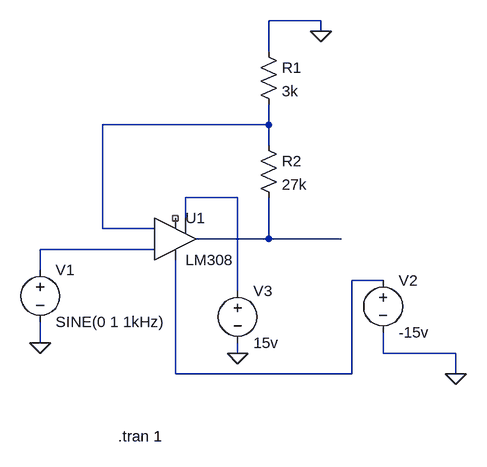
[diagram p0: schematic OpAmp.asc]
OpAmp.asc, the LTspice schematic file:
Version 4
SHEET 1 880 680
WIRE 448 -160 368 -160
WIRE 448 -144 448 -160
WIRE 368 -112 368 -160
WIRE 368 0 368 -32
WIRE 368 0 112 0
WIRE 368 32 368 0
WIRE 320 112 240 112
WIRE 240 144 240 112
WIRE 112 160 112 0
WIRE 192 160 112 160
WIRE 368 176 368 112
WIRE 368 176 256 176
WIRE 480 176 368 176
WIRE 192 192 16 192
WIRE 16 224 16 192
WIRE 544 240 496 240
WIRE 320 256 320 112
WIRE 16 336 16 304
WIRE 320 352 320 336
WIRE 544 352 544 320
WIRE 656 352 544 352
WIRE 224 384 224 208
WIRE 496 384 496 240
WIRE 496 384 224 384
WIRE 656 384 656 352
FLAG 16 336 0
FLAG 448 -144 0
FLAG 320 352 0
FLAG 656 384 0
SYMBOL Opamps\\LM308 224 112 R0
SYMATTR InstName U1
SYMBOL res 352 16 R0
SYMATTR InstName R2
SYMATTR Value 27k
SYMBOL res 352 -128 R0
SYMATTR InstName R1
SYMATTR Value 3k
SYMBOL voltage 320 240 R0
SYMATTR InstName V3
SYMATTR Value 15v
SYMBOL voltage 544 224 R0
SYMATTR InstName V2
SYMATTR Value -15v
SYMBOL voltage 16 208 R0
WINDOW 123 0 0 Left 0
WINDOW 39 0 0 Left 0
SYMATTR InstName V1
SYMATTR Value SINE(0 1 1kHz)
TEXT 136 480 Left 2 !.tran 1

The netlist it stands for:
* OpAmp.asc
XU1 N004 N001 N002 N005 N003 NC_01 NC_02 LT1008
R2 N001 N003 27k
R1 0 N001 3k
V3 N002 0 15v
V2 N005 0 -15v
V1 N004 0 SINE(0 1 1kHz)
.tran 1
.lib LTC.lib
.backanno
.end